# EAGLE design DASH_BOARD_V_2.0 (EAGLE 9.2.2)
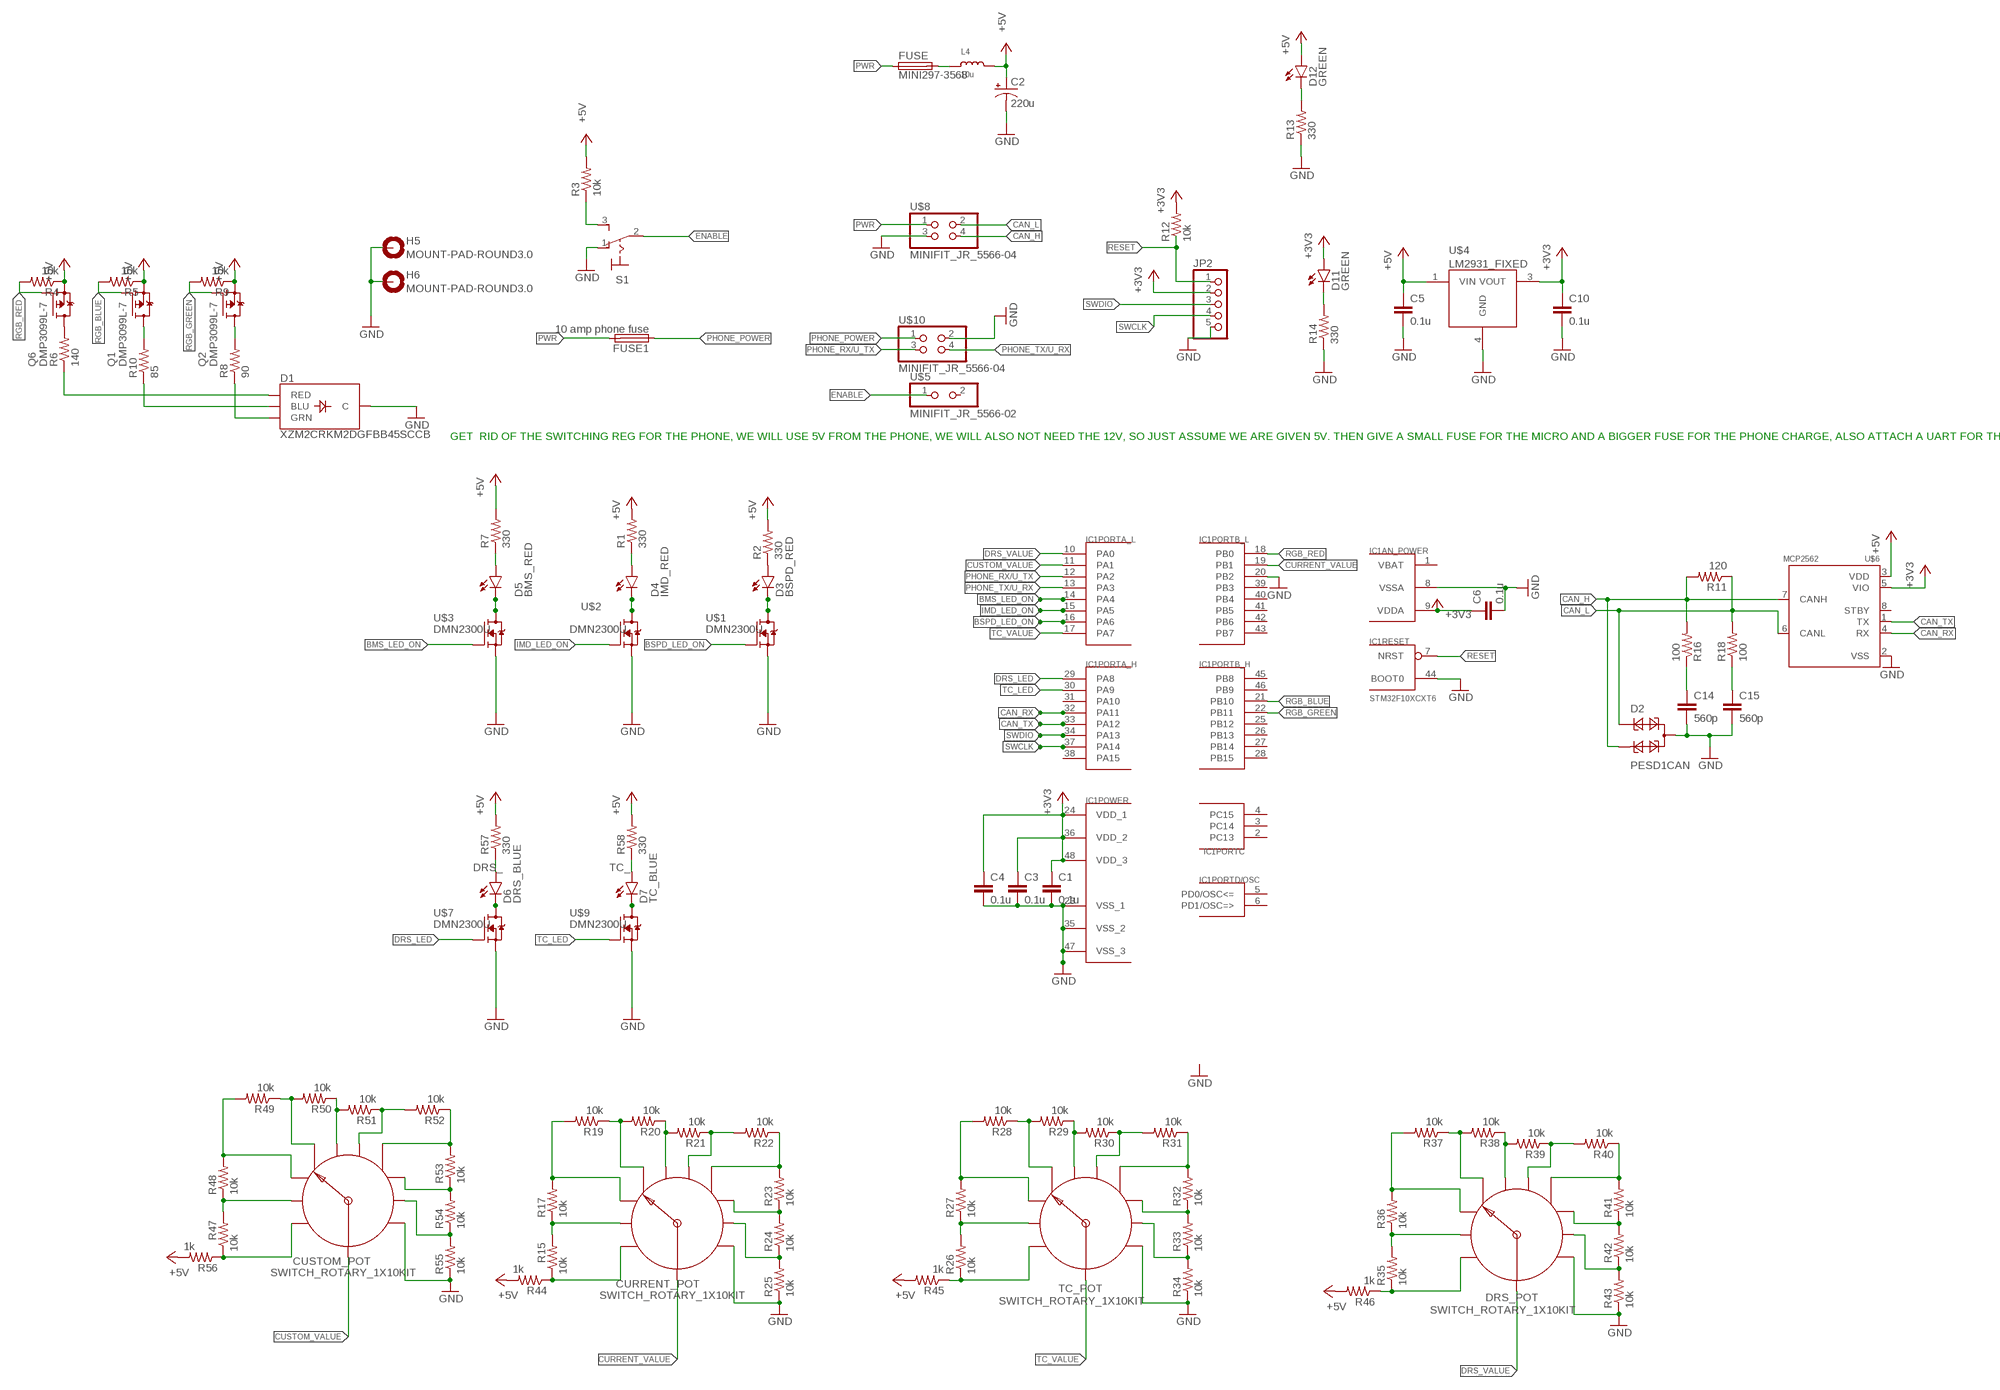
[diagram p0: schematic, sheet 1]

## Parts
C1  0.1u  C-EUC0805K  [C0805K]
C2  220u  CPOL-USE2.5-7  [E2,5-7]
C3  0.1u  C-EUC0805K  [C0805K]
C4  0.1u  C-EUC0805K  [C0805K]
C5  0.1u  C-EUC0805K  [C0805K]
C6  0.1u  C-EUC0805K  [C0805K]
C10  0.1u  C-EUC0805K  [C0805K]
C14  560p  C-EUC0805K  [C0805K]
C15  560p  C-EUC0805K  [C0805K]
CURRENT_POT  SWITCH_ROTARY_1X10KIT  [ROTARY_SWITCH_1X10_KIT]
CUSTOM_POT  SWITCH_ROTARY_1X10KIT  [ROTARY_SWITCH_1X10_KIT]
D1  XZM2CRKM2DGFBB45SCCB  SUNLEDSMD1  [PLCC4SMDLED]
D2  PESD1CAN  [SOT23]
D3  BSPD_RED  LED-GREEN0603  [LED-0603]
D4  IMD_RED  LED-GREEN0603  [LED-0603]
D5  BMS_RED  LED-GREEN0603  [LED-0603]
D6  DRS_BLUE  LED-GREEN0603  [LED-0603]
D7  TC_BLUE  LED-GREEN0603  [LED-0603]
D11  GREEN  LED-GREEN0603  [LED-0603]
D12  GREEN  LED-GREEN0603  [LED-0603]
DRS_POT  SWITCH_ROTARY_1X10KIT  [ROTARY_SWITCH_1X10_KIT]
FUSE  MINI297-3568  [3568]
FUSE1  10 amp phone fuse  MINI297-3568  [3568]
H5  MOUNT-PAD-ROUND3.0  [3,0-PAD]
H6  MOUNT-PAD-ROUND3.0  [3,0-PAD]
IC1  STM32F10XCXT6  [TQFP48]
JP2  PINHD-1X5  [1X05]
L4  10u  INDUCTORNR5040  [INDUCTOR_5X5MM_NR5040_NOTHERMALS]
Q1  DMP3099L-7  [SOT23]
Q2  DMP3099L-7  [SOT23]
Q6  DMP3099L-7  [SOT23]
R1  330  R-US_R0805  [R0805]
R2  330  R-US_R0805  [R0805]
R3  10k  R-US_R0805  [R0805]
R4  10k  R-US_R0805  [R0805]
R5  10k  R-US_R0805  [R0805]
R6  140  R-US_R0805  [R0805]
R7  330  R-US_R0805  [R0805]
R8  90  R-US_R0805  [R0805]
R9  10k  R-US_R0805  [R0805]
R10  85  R-US_R0805  [R0805]
R11  120  R-US_R0805  [R0805]
R12  10k  R-US_R0805  [R0805]
R13  330  R-US_R0603  [R0603]
R14  330  R-US_R0603  [R0603]
R15  10k  R-US_R0805  [R0805]
R16  100  R-US_R0805  [R0805]
R17  10k  R-US_R0805  [R0805]
R18  100  R-US_R0805  [R0805]
R19  10k  R-US_R0805  [R0805]
R20  10k  R-US_R0805  [R0805]
R21  10k  R-US_R0805  [R0805]
R22  10k  R-US_R0805  [R0805]
R23  10k  R-US_R0805  [R0805]
R24  10k  R-US_R0805  [R0805]
R25  10k  R-US_R0805  [R0805]
R26  10k  R-US_R0805  [R0805]
R27  10k  R-US_R0805  [R0805]
R28  10k  R-US_R0805  [R0805]
R29  10k  R-US_R0805  [R0805]
R30  10k  R-US_R0805  [R0805]
R31  10k  R-US_R0805  [R0805]
R32  10k  R-US_R0805  [R0805]
R33  10k  R-US_R0805  [R0805]
R34  10k  R-US_R0805  [R0805]
R35  10k  R-US_R0805  [R0805]
R36  10k  R-US_R0805  [R0805]
R37  10k  R-US_R0805  [R0805]
R38  10k  R-US_R0805  [R0805]
R39  10k  R-US_R0805  [R0805]
R40  10k  R-US_R0805  [R0805]
R41  10k  R-US_R0805  [R0805]
R42  10k  R-US_R0805  [R0805]
R43  10k  R-US_R0805  [R0805]
R44  1k  R-US_R0805  [R0805]
R45  1k  R-US_R0805  [R0805]
R46  1k  R-US_R0805  [R0805]
R47  10k  R-US_R0805  [R0805]
R48  10k  R-US_R0805  [R0805]
R49  10k  R-US_R0805  [R0805]
R50  10k  R-US_R0805  [R0805]
R51  10k  R-US_R0805  [R0805]
R52  10k  R-US_R0805  [R0805]
R53  10k  R-US_R0805  [R0805]
R54  10k  R-US_R0805  [R0805]
R55  10k  R-US_R0805  [R0805]
R56  1k  R-US_R0805  [R0805]
R57  330  R-US_R0805  [R0805]
R58  330  R-US_R0805  [R0805]
S1  320-916  [320-916]
TC_POT  SWITCH_ROTARY_1X10KIT  [ROTARY_SWITCH_1X10_KIT]
U$1  DMN2300U  [SOT23]
U$2  DMN2300U  [SOT23]
U$3  DMN2300U  [SOT23]
U$4  LM2931_FIXED  [DPAK]
U$5  MINIFIT_JR_5566-02  [MINIFIT_JR_5566-02]
U$6  MCP2562  [SOIC8]
U$7  DMN2300U  [SOT23]
U$8  MINIFIT_JR_5566-04  [MINIFIT_JR_5566-04]
U$9  DMN2300U  [SOT23]
U$10  MINIFIT_JR_5566-04  [MINIFIT_JR_5566-04]

## Nets
+3V3: C1.1 C3.1 C4.1 C6.1 C10.1 D11.A IC1.9(AN_POWER:VDDA) IC1.24(POWER:VDD_1) IC1.36(POWER:VDD_2) IC1.48(POWER:VDD_3) JP2.2 R12.2 U$4.3(VOUT) U$6.5(VIO)
+5V: C2.+ C5.1 D12.A L4.P$2 Q1.2(S) Q2.2(S) Q6.2(S) R1.2 R2.2 R3.2 R4.1 R5.1 R7.2 R9.1 R44.2 R45.2 R46.2 R56.2 R57.2 R58.2 U$4.1(VIN) U$6.3(VDD)
BMS_LED: D5.A R7.1
BMS_LED_ON: IC1.14(PORTA_L:PA4) U$3.1(G)
BSPD_LED: D3.A R2.1
BSPD_LED_ON: IC1.16(PORTA_L:PA6) U$1.1(G)
CAN_H: D2.2 R11.2 R16.2 U$6.7(CANH) U$8.4
CAN_L: D2.1 R11.1 R18.2 U$6.6(CANL) U$8.2
CAN_RX: IC1.32(PORTA_H:PA11) U$6.4(RX)
CAN_TX: IC1.33(PORTA_H:PA12) U$6.1(TX)
CURRENT_VALUE: CURRENT_POT.COMMON IC1.19(PORTB_L:PB1)
CUSTOM_VALUE: CUSTOM_POT.COMMON IC1.11(PORTA_L:PA1)
DRS_: D6.A R57.1
DRS_LED: IC1.29(PORTA_H:PA8) U$7.1(G)
DRS_VALUE: DRS_POT.COMMON IC1.10(PORTA_L:PA0)
ENABLE: S1.2(P) U$5.1
GND: C1.2 C2.- C3.2 C4.2 C5.2 C6.2 C10.2 C14.2 C15.2 CURRENT_POT.10 CUSTOM_POT.10 D1.4(C) D2.3 DRS_POT.10 H5.B3,0(MOUNT) H6.B3,0(MOUNT) IC1.8(AN_POWER:VSSA) IC1.20(PORTB_L:PB2) IC1.23(POWER:VSS_1) IC1.35(POWER:VSS_2) IC1.44(RESET:BOOT0) IC1.47(POWER:VSS_3) JP2.5 R13.1 R14.1 R25.1 R34.1 R43.1 R55.1 S1.1(O) TC_POT.10 U$1.2(S) U$2.2(S) U$3.2(S) U$4.4(GND) U$6.2(VSS) U$7.2(S) U$8.3 U$9.2(S) U$10.2
IMD_LED: D4.A R1.1
IMD_LED_ON: IC1.15(PORTA_L:PA5) U$2.1(G)
N$1: Q6.3(D) R6.2
N$2 [PWR]: C14.1 R16.1
N$3: D5.C U$3.3(D)
N$4: R3.1 S1.3(S)
N$5: D1.2(GRN) R8.1
N$6 [PWR_IN]: FUSE.P$2 FUSE.P$3 L4.P$1
N$7: CURRENT_POT.2 R15.2 R17.1
N$8: D4.C U$2.3(D)
N$9 [PWR]: C15.1 R18.1
N$10: D12.C R13.2
N$11: D11.C R14.2
N$12: D3.C U$1.3(D)
N$13: CURRENT_POT.3 R17.2 R19.2
N$14: CURRENT_POT.1 R15.1 R44.1
N$15: D1.3(BLU) R10.1
N$16: D1.1(RED) R6.1
N$17: CURRENT_POT.4 R19.1 R20.2
N$18: CURRENT_POT.5 R20.1 R21.2
N$19: CURRENT_POT.6 R21.1 R22.2
N$20: CURRENT_POT.7 R22.1 R23.2
N$21: CURRENT_POT.8 R23.1 R24.2
N$22: CURRENT_POT.9 R24.1 R25.2
N$23: R26.1 R45.1 TC_POT.1
N$24: Q1.3(D) R10.2
N$25: R26.2 R27.1 TC_POT.2
N$26: R27.2 R28.2 TC_POT.3
N$27: Q2.3(D) R8.2
N$28: R28.1 R29.2 TC_POT.4
N$29: R29.1 R30.2 TC_POT.5
N$30: R30.1 R31.2 TC_POT.6
N$31: R31.1 R32.2 TC_POT.7
N$32: R32.1 R33.2 TC_POT.8
N$33: R33.1 R34.2 TC_POT.9
N$34: CUSTOM_POT.2 R47.2 R48.1
N$35: CUSTOM_POT.3 R48.2 R49.2
N$36: DRS_POT.2 R35.2 R36.1
N$37: DRS_POT.3 R36.2 R37.2
N$38: DRS_POT.1 R35.1 R46.1
N$39: DRS_POT.4 R37.1 R38.2
N$40: DRS_POT.5 R38.1 R39.2
N$41: DRS_POT.6 R39.1 R40.2
N$42: DRS_POT.7 R40.1 R41.2
N$43: DRS_POT.8 R41.1 R42.2
N$44: DRS_POT.9 R42.1 R43.2
N$45: CUSTOM_POT.4 R49.1 R50.2
N$46: CUSTOM_POT.5 R50.1 R51.2
N$47: CUSTOM_POT.6 R51.1 R52.2
N$48: CUSTOM_POT.7 R52.1 R53.2
N$49: CUSTOM_POT.8 R53.1 R54.2
N$50: CUSTOM_POT.9 R54.1 R55.2
N$51: CUSTOM_POT.1 R47.1 R56.1
N$52: D6.C U$7.3(D)
N$53: D7.C U$9.3(D)
PHONE_POWER: FUSE1.P$1 FUSE1.P$4 U$10.1
PHONE_RX/U_TX: IC1.12(PORTA_L:PA2) U$10.3
PHONE_TX/U_RX: IC1.13(PORTA_L:PA3) U$10.4
PWR [PWR_IN]: FUSE1.P$2 FUSE1.P$3 FUSE.P$1 FUSE.P$4 U$8.1
RESET: IC1.7(RESET:NRST) JP2.1 R12.1
RGB_BLUE: IC1.21(PORTB_H:PB10) Q1.1(G) R5.2
RGB_GREEN: IC1.22(PORTB_H:PB11) Q2.1(G) R9.2
RGB_RED: IC1.18(PORTB_L:PB0) Q6.1(G) R4.2
SWCLK: IC1.37(PORTA_H:PA14) JP2.4
SWDIO: IC1.34(PORTA_H:PA13) JP2.3
TC_: D7.A R58.1
TC_LED: IC1.30(PORTA_H:PA9) U$9.1(G)
TC_VALUE: IC1.17(PORTA_L:PA7) TC_POT.COMMON
Unconnected: IC1.2(PORTC:PC13) IC1.3(PORTC:PC14) IC1.4(PORTC:PC15) IC1.5(PORTD/OSC:PD0/OSC<=) IC1.6(PORTD/OSC:PD1/OSC=>) IC1.25(PORTB_H:PB12) IC1.26(PORTB_H:PB13) IC1.27(PORTB_H:PB14) IC1.28(PORTB_H:PB15) IC1.31(PORTA_H:PA10) IC1.38(PORTA_H:PA15) IC1.39(PORTB_L:PB3) IC1.40(PORTB_L:PB4) IC1.41(PORTB_L:PB5) IC1.42(PORTB_L:PB6) IC1.43(PORTB_L:PB7) IC1.45(PORTB_H:PB8) IC1.46(PORTB_H:PB9) U$5.2 U$6.8(STBY)

## Notes on the sheet
- GET  RID OF THE SWITCHING REG FOR THE PHONE, WE WILL USE 5V FROM THE PHONE, WE WILL ALSO NOT NEED THE 12V, SO JUST ASSUME WE ARE GIVEN 5V. THEN GIVE A SMALL FUSE FOR THE MICRO AND A BIGGER FUSE FOR THE PHONE CHARGE, ALSO ATTACH A UART FOR THE PHONE

## Power pins joined to a net without a drawn wire
VBAT: IC1.1(AN_POWER:VBAT)

## Library data of the parts
C1 C3-C6 C10 C14 C15 = rcl:C-EU: CAPACITOR, European symbol
C2 = rcl:CPOL-US: POLARIZED CAPACITOR, American symbol; SPICEPREFIX: C
CURRENT_POT CUSTOM_POT DRS_POT TC_POT = Testing:SWITCH_ROTARY_1X10: SWCH-12120; PROD_ID: SWCH-12120; VALUE: 1x10
D1 = SparkFun-LED:SUNLED: LED-RGB Common Cathode XZM2CRKM2DGFBB45SCCB Packages: PLCC4 SparkFun Products: Lilypad Prototyping Board <[https://www.sparkfun.com/products/9264]>; PROD_ID: DIO-13722
D2 = diode:PESD1CAN: CAN bus ESD protection diode Source: http://www.nxp.com/documents/data_sheet/PESD1CAN.pdf
D3-D7 = SparkFun-LED:LED-GREEN: Various green LEDs Green LEDs used in SFE Production 0603- DIO-00821 LARGE- DIO-00862 LILYPAD- DIO-09910; PROD_ID: DIO-00821; VALUE: GREEN
D11 D12 = SparkFun-LED:LED-GREEN: Various green LEDs Green LEDs used in SFE Production 0603- DIO-00821 LARGE- DIO-00862 LILYPAD- DIO-09910; PROD_ID: DIO-00821
FUSE FUSE1 = Fuse:MINI297-3568
H5 H6 = holes:MOUNT-PAD-ROUND: MOUNTING PAD, round
IC1 = stm32:STM32F10XCXT6: ST STM32F101/103 48pin LQFP
JP2 = Headers_IFE:PINHD-1X5: PIN HEADER
L4 = microbuilder:INDUCTOR: Inductors 0603: 10nH Ceramic Inductor - microwire antenna/RF (Digikey: 712-1434-2-ND) 0805: 560nH Ceramic Inductor - RF (Digikey: 553-1047-1-ND) 270nH Ceramic Inductor - Q = 40@250MHz, +-5%, 1 Ohm DC Resistance (Digikey: 535-10506-2-ND) 1007 (2518 Metric) SMT: 10µH 10% 250mOhm 820mA 1007 Inductor (Digikey: 587-2189-1-ND) 22µH 10% 500mOhm 580mA 1007 Inductor (Digikey: 587-2190-1-ND) 47µH 10% 950mOhm 420mA 1007 Inductor (Digikey: 587-2191-1-ND) 47µH 5% 100mOhm 1A 1008 Inductor (Digikey: 732-1816-1-ND) 5.0x5.0mm (Taiyo Yuden NR5040 Series) 6.8µH 20% 2.3A 64mOhm Inductor (Digikey: 587-2374-2-ND) 5.0x5.0mm (TDK VLC5045 Series) 4.7µH 20% 3.3A 34mOhm Inductor (Digikey: 445-6526-1-ND) 6.8µH 20% 2.7A 46mOhm Inductor (Digikey: 445-6527-1-ND) 6.0x6.0mm (TDK VLC6045 Series) 4.7µH 20% 3.8A 27mOhm Inductor (Digikey: 445-6538-2-ND) 6.8µH 20% 3A 41mOhm Inductor (Digikey: 445-6540-1-ND) 6.2µH 30% 2.2A 45mOhm Inductor (Digikey: SRR5028-6R2YCT-ND) - Not TDK VLC6045 but footprint should match 6.0x6.0mm (TDK SLF6045 Series) 6.8uH 30% 2A 33mOhm Inductor (Digikey: 445-4572-1-ND, Mouser: 810-SLF645T6R8N2R0PF) 6.0x6.0mm (Sumida CDRH5D28 Series) 6.2uH 30% 1.8A 45mOhm Inductor (Digikey: 308-1542-1-ND) Taiyo Yuden NR3015T2R2M - 2.2uH 20% 1.5A (Digikey: 587-1648-2-ND, Mouser: 963-NR3015T2R2M) - Used with TI TPS62172 CoilCraft RFID Transponder Coil - MA5532-AE (For use with AS3935 Lightning Sensor)
Q1 Q2 Q6 = TRANS:DMP3099L-7: DMP3099L-7 P-Channel Vgs(th) = 2.1V, Rds(on) = 64 mohm, Vds(max) = 30V
R1-R10 R12 R15 R17 R19-R58 = resistor:R-US_: RESISTOR, American symbol
R11 R16 R18 = rcl:R-US_: RESISTOR, American symbol
R13 R14 = rcl:R-US_: RESISTOR, American symbol; SPICEPREFIX: R
S1 = switch:320-916: TOGGLE SWITCH distributor RS Components
U$1-U$3 U$7 U$9 = Display_Custom:DMN2300U: 20V N-Channel Mosfet SOT23 https://www.diodes.com/assets/Datasheets/DMN2300U.pdf
U$4 = SparkFun-PowerIC:LM2931_FIXED: LDO regulator with reverse battery protection- very durable!
U$5 = Display_Custom:MINIFIT_JR_5566-02: Molex Minifit JR 5566-02 Vertical 2 position headder https://www.molex.com/pdm_docs/sd/039293026_sd.pdf
U$6 = MICROCHIP:MCP2562: MCP2562 High Speed CAN Tranceiver The MCP2561/2 is Microchip Technology Inc. second generation high-speed CAN transceiver. It serves as an interface between a CAN protocol controller and the physical two-wire CAN bus. The device meets the automotive requirements for high-speed (1 Mb/s), low quiescent current, electromagnetic compatibility (EMC) and electrostatic discharge (ESD). The device family members are: • MCP2561 with SPLIT pin • MCP2562 with VIO pin Datasheet <http://ww1.microchip.com/downloads/en/DeviceDoc/20005167C.pdf> Microchip <https://www.microchip.com/wwwproducts/en/MCP2562> Digikey <https://www.digikey.com/product-detail/en/microchip-technology/MCP2562T-E-SN/MCP2562T-E-SNCT-ND/5011025>
U$8 U$10 = Display_Custom:MINIFIT_JR_5566-04: Molex Minifit JR 5566-04 Vertical 4 position headder https://www.molex.com/pdm_docs/sd/039293026_sd.pdf

## Net classes
0 default: width 0.254 mm
1 PWR: width 0.254 mm
3 PWR_IN: width 0.406 mm

## Board
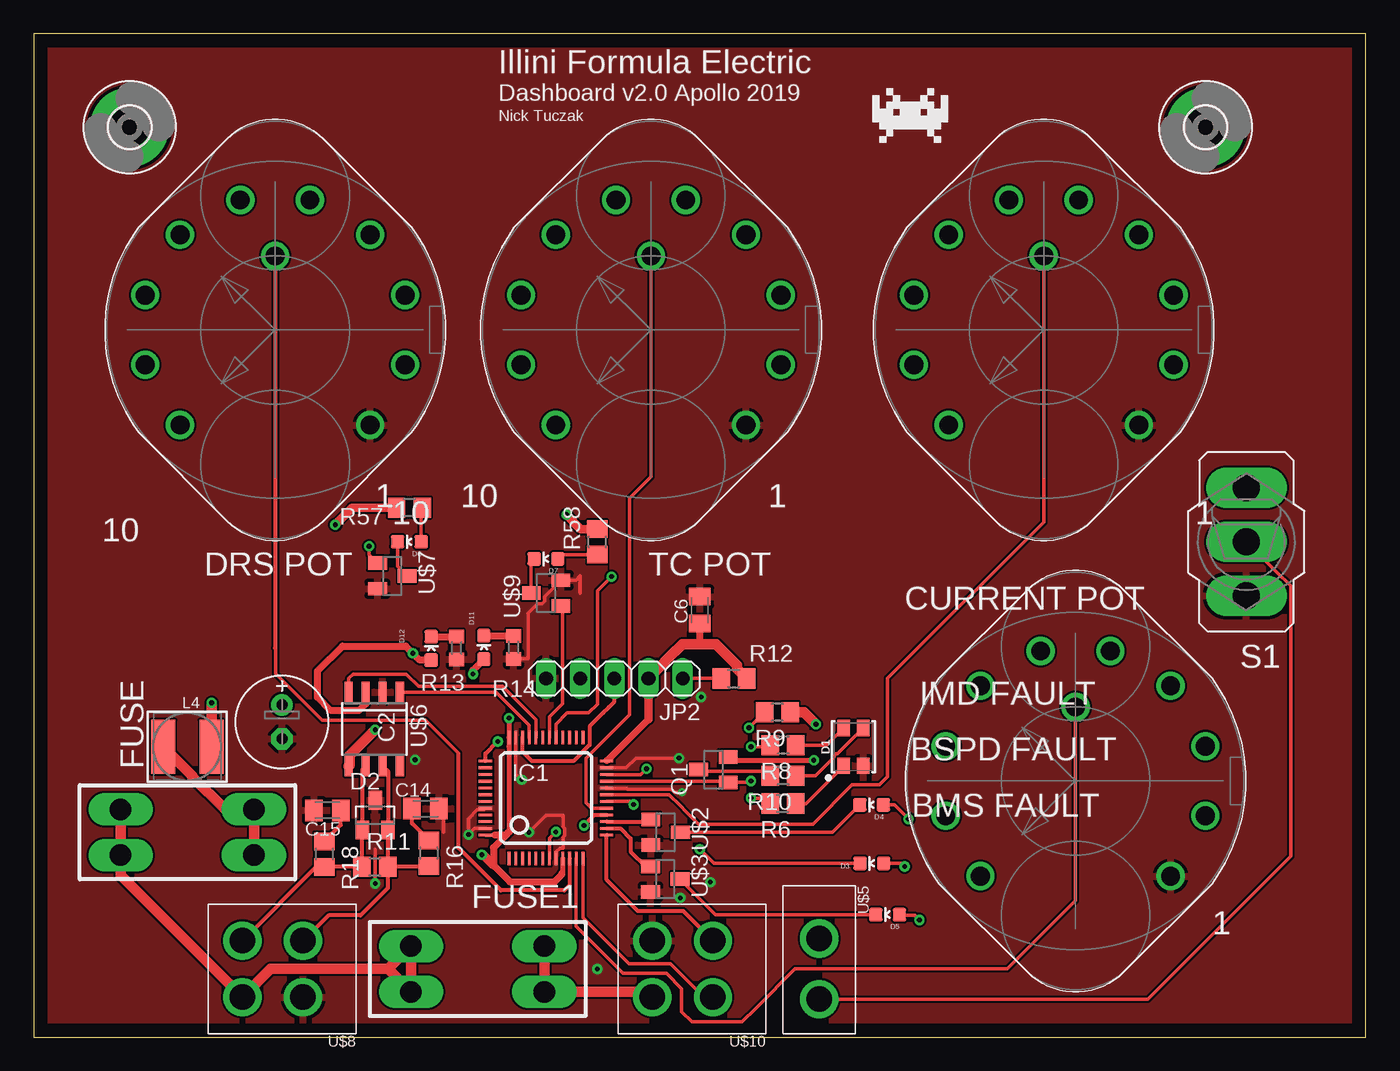
[diagram p1: board, top side]
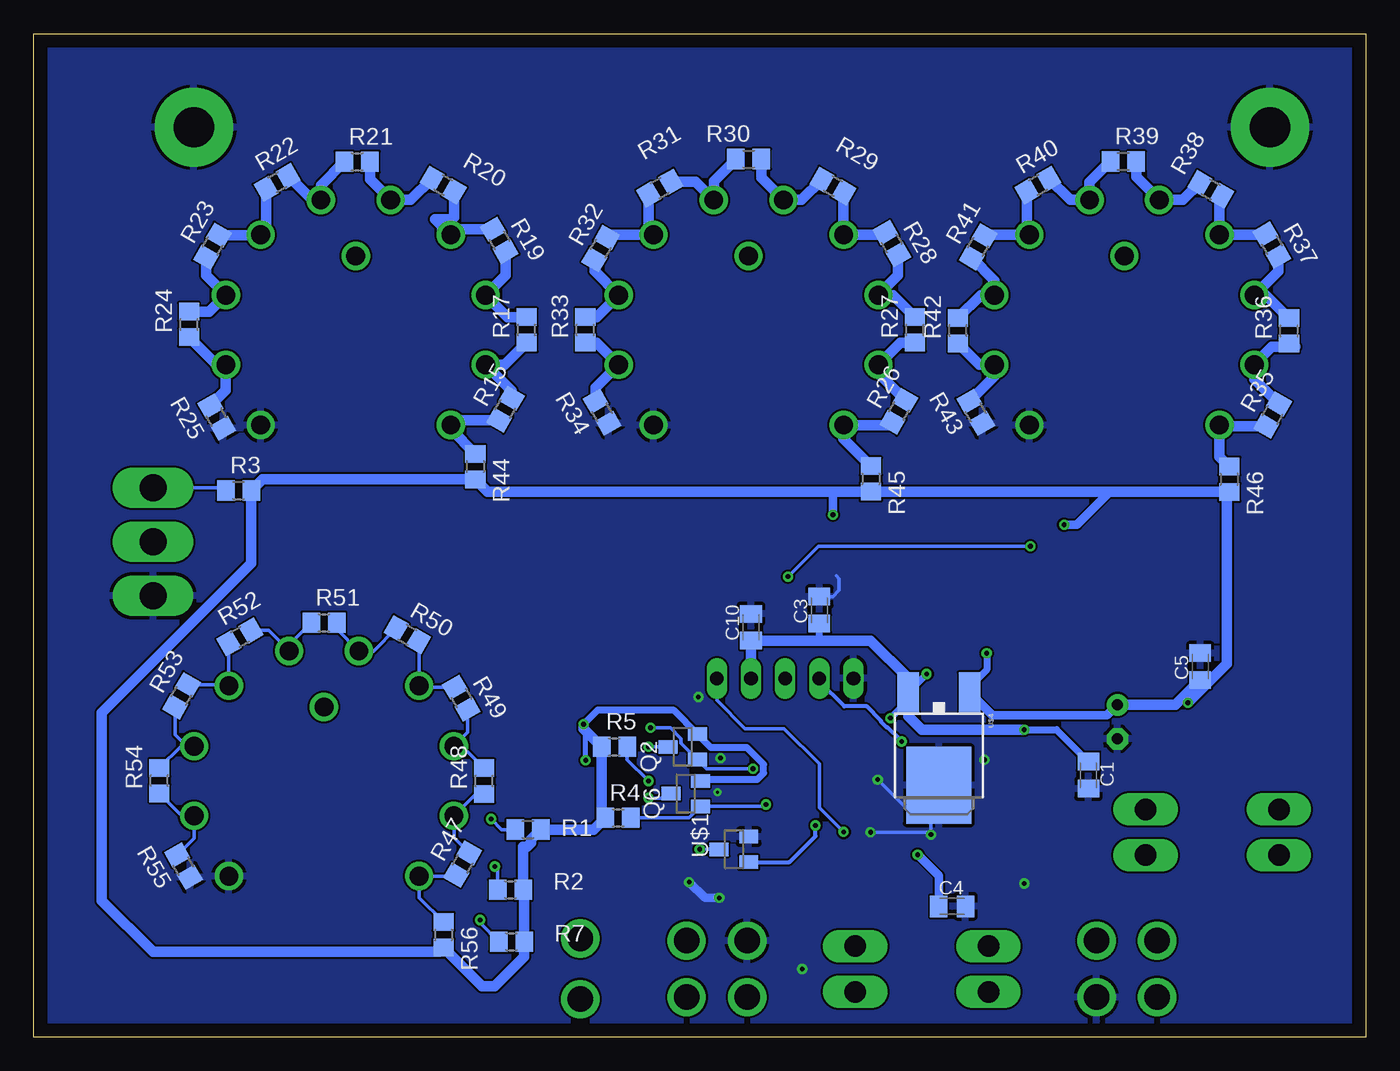
[diagram p2: board, bottom side, seen from below]

Size 99.06 x 74.6 mm. Coordinates in mm from the lower left corner, seen from the top.
Outline: 0,0 99.06,0 99.04,74.6 0,74.6 0,0
Copper layers (1*16): Top 0.035mm / dielectric 1.5mm / Bottom 0.035mm
Design rules "default": minimum track width 6mil, minimum drill 0.35mm, track to track 6mil, track to pad 6mil, pad to pad 6mil, via to via 6mil, smd to smd 6mil, copper to edge 40mil, drill to drill 6mil, minimum pad ring 10mil, minimum via ring 8mil, stop-mask expansion 4mil, vias tented up to drill 0mil, thermal gap 10mil

### Footprints (pad centres in the part's own frame; a part is rotated, then mirrored left to right if it is on the bottom)
C0805K = smd 1.3 x 1.6: 1 -1,0; 2 1,0
E2,5-7 = drill 0.813 pad 1.6: + -1.27,0 | drill 0.813 pad 1.6 octagon: - 1.27,0
ROTARY_SWITCH_1X10_KIT = drill 1.4: 1 7.071,7.071; 2 9.659,2.588; 3 9.659,-2.588; 4 7.071,-7.071; 5 2.588,-9.659; 6 -2.588,-9.659; 7 -7.071,-7.071; 8 -9.659,-2.588; 9 -9.659,2.588; 10 -7.071,7.071; COMMON 0,-5.5
PLCC4SMDLED = smd 1.2 x 0.9: 1 -1.4,0.725; 2 1.4,0.725; 3 1.4,-0.725; 4 -1.4,-0.725
SOT23 = smd 1 x 1.4: 1 -0.95,-1.1; 2 0.95,-1.1; 3 0,1.1
LED-0603 = smd 1 x 1: A 0,-0.877; C 0,0.877
3568 = drill 1.6 long: P$1 -4.96,1.7; P$2 4.96,1.7; P$3 4.96,-1.7; P$4 -4.96,-1.7
3,0-PAD = drill 3 pad 5.842: B3,0 0,0
TQFP48 = smd 0.2 x 1: 1 -2.75,-4.5; 2 -2.25,-4.5; 3 -1.75,-4.5; 4 -1.25,-4.5; 5 -0.75,-4.5; 6 -0.25,-4.5; 7 0.25,-4.5; 8 0.75,-4.5; 9 1.25,-4.5; 10 1.75,-4.5; 11 2.25,-4.5; 12 2.75,-4.5; 25 2.75,4.5; 26 2.25,4.5; 27 1.75,4.5; 28 1.25,4.5; 29 0.75,4.5; 30 0.25,4.5; 31 -0.25,4.5; 32 -0.75,4.5; 33 -1.25,4.5; 34 -1.75,4.5; 35 -2.25,4.5; 36 -2.75,4.5 | smd 1 x 0.2: 13 4.5,-2.75; 14 4.5,-2.25; 15 4.5,-1.75; 16 4.5,-1.25; 17 4.5,-0.75; 18 4.5,-0.25; 19 4.5,0.25; 20 4.5,0.75; 21 4.5,1.25; 22 4.5,1.75; 23 4.5,2.25; 24 4.5,2.75; 37 -4.5,2.75; 38 -4.5,2.25; 39 -4.5,1.75; 40 -4.5,1.25; 41 -4.5,0.75; 42 -4.5,0.25; 43 -4.5,-0.25; 44 -4.5,-0.75; 45 -4.5,-1.25; 46 -4.5,-1.75; 47 -4.5,-2.25; 48 -4.5,-2.75
1X05 = drill 1.016 long: 1 -5.08,0; 2 -2.54,0; 3 0,0; 4 2.54,0; 5 5.08,0
INDUCTOR_5X5MM_NR5040_NOTHERMALS = smd 1.8 x 4: P$1 -1.8,0; P$2 1.8,0
R0805 = smd 1.3 x 1.5: 1 -0.95,0; 2 0.95,0
R0603 = smd 1 x 1.1: 1 -0.85,0; 2 0.85,0
320-916 = drill 2.007 long: 1 0,4.013; 2 0,0; 3 0,-4.013
DPAK = smd 1.6 x 3: 1 -2.28,-5.31; 3 2.28,-5.31 | smd 4.826 x 5.715: 4 0,1.588
MINIFIT_JR_5566-02 = drill 1.9: 1 0,2.25; 2 0,-2.25
SOIC8 = smd 0.6 x 1.5: 1 -1.905,-2.75; 2 -0.635,-2.75; 3 0.635,-2.75; 4 1.905,-2.75; 5 1.905,2.75; 6 0.635,2.75; 7 -0.635,2.75; 8 -1.905,2.75
MINIFIT_JR_5566-04 = drill 1.9: 1 -2.1,2.25; 2 2.1,2.25; 3 -2.1,-2.25; 4 2.1,-2.25

### Placement (x,y rotation side)
C1  20.62,19.48 270 bottom
C2  18.47,23.44 270 top
C3  40.64,31.75 90 bottom
C4  30.76,9.73 0 bottom
C5  12.32,27.56 90 bottom
C6  49.53,31.75 90 top
C10  45.72,30.48 90 bottom
C14  29.13,16.99 0 top
C15  21.84,16.87 180 top
CURRENT_POT  75.11,52.58 180 top
CUSTOM_POT  77.47,19.05 180 top
D1  60.96,21.59 90 top
D2  25.4,16.51 0 top
D3  62.33,12.93 90 top
D4  62.31,17.27 90 top
D5  63.5,9.12 90 top
D6  27.94,36.83 90 top
D7  38.1,35.56 90 top
D11  33.48,28.98 0 top
D12  29.57,28.91 0 top
DRS_POT  17.96,52.58 180 top
FUSE  11.43,15.24 0 top
FUSE1  33.02,5.08 180 top
H5  87.15,67.64 0 top
H6  7.14,67.64 180 top
IC1  38.1,17.78 0 top
JP2  43.18,26.67 180 top
L4  11.43,21.59 0 top
Q1  50.55,19.89 90 top
Q2  50.8,21.59 90 bottom
Q6  50.57,18.11 90 bottom
R1  62.31,15.44 0 bottom
R2  63.6,10.97 0 bottom
R3  83.82,40.64 0 bottom
R4  55.6,16.31 0 bottom
R5  55.88,21.59 0 bottom
R6  55.7,17.37 180 top
R7  63.53,7.11 0 bottom
R8  55.73,21.72 180 top
R9  55.3,24.16 180 top
R10  55.73,19.43 180 top
R11  25.37,12.67 0 top
R12  52.07,26.67 0 top
R13  31.45,28.93 90 top
R14  35.69,28.98 90 top
R15  63.98,46.69 60 bottom
R16  29.39,13.69 270 top
R17  62.41,52.58 90 bottom
R18  21.62,13.61 270 top
R19  64.44,59.23 300 bottom
R20  68.61,63.35 330 bottom
R21  75.01,65.07 0 bottom
R22  80.95,63.55 30 bottom
R23  85.75,58.8 60 bottom
R24  87.5,52.98 90 bottom
R25  85.45,46.1 120 bottom
R26  34.72,46.53 60 bottom
R27  33.53,52.58 90 bottom
R28  35.26,59 300 bottom
R29  39.62,63.27 330 bottom
R30  45.9,65.28 0 bottom
R31  52.5,63.12 30 bottom
R32  56.9,58.62 60 bottom
R33  58.04,52.58 90 bottom
R34  56.79,46.46 120 bottom
R35  6.93,46.25 60 bottom
R36  5.71,52.5 90 bottom
R37  6.99,58.88 300 bottom
R38  11.53,63.02 330 bottom
R39  18.03,65.1 0 bottom
R40  24.38,63.35 30 bottom
R41  28.83,58.75 60 bottom
R42  30.33,52.53 90 bottom
R43  29.01,46.46 120 bottom
R44  66.22,42.42 270 bottom
R45  36.8,41.5 270 bottom
R46  10.16,41.48 270 bottom
R47  67.16,12.88 60 bottom
R48  65.56,19.05 90 bottom
R49  67.26,25.2 300 bottom
R50  71.27,29.92 330 bottom
R51  77.47,30.81 0 bottom
R52  83.72,29.77 30 bottom
R53  88.06,25.37 60 bottom
R54  89.71,19.08 90 bottom
R55  87.91,12.73 120 bottom
R56  68.58,7.62 270 bottom
R57  27.94,39.37 180 top
R58  41.91,36.83 90 top
S1  90.17,36.83 180 top
TC_POT  45.9,52.58 180 top
U$1  46.99,13.97 90 bottom
U$2  46.99,15.24 270 top
U$3  46.96,11.76 270 top
U$4  31.75,20.32 180 bottom
U$5  58.42,5.08 180 top
U$6  25.32,22.91 180 top
U$7  26.67,34.29 270 top
U$8  17.78,5.08 90 top
U$9  38.1,33.02 90 top
U$10  48.26,5.08 90 top

### Tracks (layer width: path | path; a pad name or v marks a point on that pad's centre or on a via)
+3V3  (via drill 0.35)
  Top 0.254: IC1.48 34.29,15.02 | IC1.24 42.63,20.56
  Top 0.381: 39.29,12.17 39.35,12.22 IC1.9 | 35.36,15.27 35.36,21.59 35.35,21.6 IC1.36 v35.36,23.72
  Top 0.508: 35.12,15.02 34.29,15.02 | 35.12,15.02 34.19,14.1 34.19,12.78 35.41,11.56 38.73,11.56 39.29,12.11 39.29,12.17 | 35.36,15.27 35.12,15.02 | v32.66,27 32.66,27.29 D11.A | 49.53,29.21 C6.1 | 45.72,23.65 42.63,20.56
  Top 0.635: JP2.2 45.72,23.65 | 34.19,12.78 33.4,13.56 v33.33,13.56
  Top 0.762: JP2.2 46.97,27.91 46.97,27.97 47.72,28.73 47.78,28.73 48.26,29.21 49.53,29.21 50.73,29.21 52.3,27.64 52.3,27.39 R12.2 | v25.4,22.86 23.5,20.95 23.5,20.24 U$6.5
  Bottom 0.508: v35.36,23.72 34.03,25.05 U$4.3 v32.66,27 | 40.64,29.48 C3.1 | v25.4,22.86 23,22.86 C1.1 | v35.36,23.72
  Bottom 0.635: v33.33,13.56 31.76,12 C4.1
  Bottom 0.762: JP2.2 C10.1 40.64,29.48 36.84,29.48 34.03,26.67 U$4.3 34.03,23.87 33.02,22.86 v25.4,22.86
+5V  (via drill 0.35)
  Top 0.381: Q1.2 51.88,20.6 v58.01,20.6
  Top 0.508: U$6.3 24.69,24.79 24.18,24.28 22.1,24.28 21.11,25.27 21.11,27.23 22.96,29.08 27.66,29.08 v28.19,28.55 28.71,28.03 D12.A
  Top 0.635: R57.2 23.7,39.37 v22.43,38.1 | R58.2 40.68,37.78 v39.62,38.84
  Top 0.762: L4.P$2 v13.23,24.86 v13.23,24.87 | v58.17,23.27 57.28,24.16 R9.1
  Bottom 0.381: v58.01,20.6 58.01,22.77 58.17,22.93
  Bottom 0.508: v58.17,23.27 57.1,24.33 51.49,24.33 Q2.2 48.7,21.54 46.04,21.54 44.78,20.28 44.78,19.63 45.24,19.17 49.36,19.17 Q6.2 | 29.19,25.35 29.67,25.83 28.19,27.31 v28.19,28.55
  Bottom 0.635: C2.+ 19.25,23.93 27.77,23.93 29.19,25.35 U$4.1 | 19.05,40.55 21.5,38.1 v22.43,38.1 | v39.62,38.84 39.62,40.4 39.78,40.55
  Bottom 0.762: v13.23,24.87 12.32,25.78 | 12.32,25.78 C5.1 14.16,24.71 C2.+ | 12.32,25.78 10.34,27.76 10.34,40.35 | 10.34,40.35 R46.2 | R45.2 10.54,40.55 10.34,40.35 | R45.2 39.78,40.55 65.3,40.55 R44.2 82.04,41.47 R3.2 82.87,35.24 93.98,24.13 93.98,10.16 90.17,6.35 68.9,6.35 R56.2 65.72,3.81 64.77,3.81 62.58,6 R7.2 62.58,10.9 R2.2 62.65,14.15 62.64,14.16 62.38,14.16 62.07,14.47 62.07,14.73 R1.2 57.41,15.44 R4.1 56.83,16.59 R5.1 58.17,22.93 v58.17,23.27 | 19.05,40.55 R45.2
BMS_LED  (via drill 0.35)
  Top 0.254: v65.86,8.71 65.53,9.04 65.53,9.07 64.43,9.07 D5.A
  Bottom 0.254: R7.1 65.86,8.5 v65.86,8.71
BMS_LED_ON
  Top 0.305: IC1.14 43.63,15.53 44.4,14.76 44.4,13.79 45.48,12.71 U$3.1
BSPD_LED  (via drill 0.35)
  Top 0.254: D3.A 64.54,12.93 v64.77,12.7
  Bottom 0.254: v64.77,12.7 64.55,12.48 R2.1
BSPD_LED_ON  (via drill 0.35)
  Top 0.305: v40.92,15.75 41.7,16.53 IC1.16
  Bottom 0.305: U$1.1 42.86,13.02 40.92,14.96 v40.92,15.75
CAN_H
  Top 0.305: R11.2 26.32,11.09 24.31,9.07 21.92,9.07 U$8.4 | R11.2 26.35,12.7 26.35,15.21 D2.2 26.35,19.77 U$6.7 | R16.2 29.32,12.68 R11.2
CAN_L
  Top 0.305: U$8.2 21.01,12.66 21.59,12.66 | 21.59,12.66 R18.2 | 21.59,12.66 21.6,12.68 R11.1 24.43,15.38 D2.1 24.45,19.92 U$6.6
CAN_RX
  Top 0.254: IC1.32 37.35,23.61 34.87,26.09 28.63,26.09 27.71,27 23.75,27 23.42,26.67 U$6.4
CAN_TX
  Top 0.254: U$6.1 34.38,25.66 36.85,23.19 36.85,23.18 IC1.33
CURRENT_VALUE
  Top 0.254: CURRENT_POT.COMMON 75.11,38.28 63.5,26.67 63.5,19.38 62.89,18.77 60.86,18.77 57.94,15.85 49.43,15.85 48.51,16.76 48.08,17.2 47.25,18.03 IC1.19
CUSTOM_VALUE
  Top 0.254: IC1.11 40.35,8.24 43.84,4.75 47.04,4.75 48.18,3.61 48.18,1.91 48.95,1.14 52.68,1.14 53.71,2.17 53.77,2.23 56.62,5.08 72.39,5.08 77.47,10.16 CUSTOM_POT.COMMON
DRS_
  Top 0.254: D6.A 28.82,38.8 28.94,39.09 28.89,39.14 R57.1
DRS_LED  (via drill 0.35)
  Top 0.254: IC1.29 38.85,23.28 39.67,24.11 41.27,24.11 41.94,24.77 41.94,33.2 v42.98,34.24 | v24.94,36.5 24.94,35.87 U$7.1
  Bottom 0.254: v42.98,34.24 40.72,36.5 v24.94,36.5
DRS_VALUE
  Top 0.254: 31.6,21.11 29.13,23.57 21.44,23.57 17.98,27.03 17.98,28.91 17.96,28.93
  Top 0.305: IC1.10 39.85,11.3 39.47,10.92 34.75,10.92 31.6,14.07 31.6,21.11 | DRS_POT.COMMON 17.96,28.93
ENABLE
  Top 0.254: U$5.1 82.84,2.83 93.46,13.45 93.46,33.56 92.41,34.6 92.4,34.6 S1.2
GND  (via drill 0.2, 0.35)
  Top 0.254: IC1.35 35.85,19.6 v36.3,19.15 | v25.4,11.43 25.4,11.8 25.39,11.81 25.39,13.54 25.4,13.54 25.4,13.97 | IC1.47 32.8,15.53 v32.33,15.06 32.33,16.26 32.98,16.91 33.48,16.91 IC1.44 | C14.2 30.48,16.65 30.48,15.24 | IC1.8 38.85,13.78 39.13,14.06 39.37,14.06 39.37,14.87 39.49,14.99 39.49,15.54 39.37,15.66 39.37,16.51 38.1,16.51 v36.83,15.24 | IC1.23 44.06,20.03 44.78,20.75 v47.98,20.75 | 40.64,33.02 40.64,34.29 40.32,33.97 U$9.2 37.98,32.75 37.98,32.4 37.82,32.24 37.47,32.24 36.75,31.52 36.75,28.12 35.7,28.12 R14.1 | v48.21,18.21 47.64,18.21 47.42,18.44 44.15,18.44 44.07,18.52 42.61,18.52 IC1.20
  Bottom 0.254: v36.3,19.15 34.19,17.04 33.53,17.04 32.33,15.85 v32.33,15.06 32.51,15.24 v36.83,15.24 | C3.2 39.64,32.75 39.17,33.22 39.17,34.09 39.37,34.29
  Bottom 0.635: v48.08,10.36 49.15,10.36 v50.32,11.53
  other vias: 41.91,5.08 28.37,20.62 49.63,25.3
  pour Top: 0,74.93 0,0 99.06,0 99.06,74.93
  pour Bottom: 0,74.93 0,0 99.06,0 99.06,74.93
IMD_LED  (via drill 0.35)
  Top 0.254: v65.05,16.23 64.01,17.27 D4.A
  Bottom 0.254: R1.1 64.26,15.44 v65.05,16.23
IMD_LED_ON
  Top 0.305: IC1.15 45.73,16.03 U$2.1
N$1  (via drill 0.35)
  Top 0.254: v53.34,17.78 54.35,17.78 R6.2
  Bottom 0.254: Q6.3 52,17.78 v53.34,17.78
N$2
  Top 0.305: R16.1 28.13,15.89 C14.1
N$3
  Top 0.254: U$3.3 50.71,9.12 D5.C
N$4
  Bottom 0.254: S1.3 84.97,40.84 R3.1
N$5
  Top 0.254: R8.1 58.96,21.72 D1.2
N$6
  Top 0.762: FUSE.P$3 FUSE.P$2 14.23,16.94 11.8,19.37 11.8,19.42 L4.P$1
N$7
  Bottom 0.762: R15.2 63.51,48.05 CURRENT_POT.2 64.05,49.99 R17.1
N$8
  Top 0.254: U$2.3 59.4,15.24 D4.C
N$9
  Top 0.305: R18.1 22.84,15.79 C15.1
N$10
  Top 0.508: D12.C R13.2
N$11
  Top 0.508: D11.C 35.66,29.86 R14.2
N$12  (via drill 0.35)
  Top 0.254: D3.C 50.57,12.93 v49.53,13.97
  Bottom 0.254: v49.53,13.97 U$1.3
N$13
  Bottom 0.762: R17.2 63.81,53.53 CURRENT_POT.3 63.97,56.65 R19.2
N$14
  Bottom 0.381: CURRENT_POT.1 68.04,45.19
  Bottom 0.762: R44.1 68.04,45.19 68.04,45.86 R15.1
N$15
  Top 0.254: R10.1 58.13,19.43 59.51,20.81 59.51,20.91 59.67,21.07 59.76,21.07 D1.3
N$16
  Top 0.254: D1.1 57.42,17.37 R6.1
N$17
  Bottom 0.762: R19.1 68.7,60.06 67.94,60.82 | 67.94,60.82 69.2,60.82 CURRENT_POT.4 | R20.2 67.78,60.97 67.94,60.82
N$18
  Bottom 0.762: R20.1 71.01,62.24 CURRENT_POT.5 74.06,63.77 R21.2
N$19
  Bottom 0.762: R21.1 77.7,63.34 CURRENT_POT.6 78.34,62.24 R22.2
N$20
  Bottom 0.762: R22.1 81.77,60.05 CURRENT_POT.7 82.2,59.62 R23.2
N$21
  Bottom 0.762: R23.1 86.22,56.62 CURRENT_POT.8 86,53.93 R24.2
N$22
  Bottom 0.762: R25.2 84.77,48.08 CURRENT_POT.9 85.46,49.99 R24.1
N$23
  Bottom 0.762: R26.1 35.4,45.51 TC_POT.1 38.83,44.48 R45.1
N$24
  Top 0.254: Q1.3 49.55,19.79 54.42,19.79 R10.2
N$25
  Bottom 0.762: R27.1 34.6,51.63 TC_POT.2 36.24,49.35 R26.2
N$26
  Bottom 0.762: R28.2 34.78,56.62 TC_POT.3 35.17,55.17 R27.2
N$27  (via drill 0.35)
  Top 0.254: v53.34,21.59 54.65,21.59 R8.2
  Bottom 0.254: Q2.3 v53.34,21.59
N$28
  Bottom 0.762: R28.1 35.91,59.65 TC_POT.4 38.83,62.77 R29.2
N$29
  Bottom 0.762: R29.1 41.96,62.24 TC_POT.5 44.95,63.88 R30.2
N$30
  Bottom 0.762: R30.1 48.49,63.64 TC_POT.6 49.84,63.59 R31.2
N$31
  Bottom 0.762: R31.1 53.33,60.01 TC_POT.7 56.22,59.65 R32.2
N$32
  Bottom 0.762: R32.1 57.37,56.98 TC_POT.8 57.2,53.53 R33.2
N$33
  Bottom 0.762: R33.1 57.2,51.63 TC_POT.9 57.27,48.28 R34.2
N$34
  Bottom 0.254: R47.2 67.81,14.83 CUSTOM_POT.2 66.17,18.1 R48.1
N$35
  Bottom 0.254: R48.2 67.2,21.64 CUSTOM_POT.3 66.78,22.66 R49.2
N$36
  Bottom 0.762: R35.2 8.3,48.91 DRS_POT.2 6.98,51.31 5.26,51.31 5.5,51.55 R36.1
N$37
  Bottom 0.762: R36.2 7.43,55.17 DRS_POT.3 6.51,56.95 R37.2
N$38
  Bottom 0.762: R35.1 10.81,45.43 DRS_POT.1 10.89,43.16 R46.1
N$39
  Bottom 0.762: R37.1 7.51,59.65 DRS_POT.4 10.89,62.37 R38.2
N$40
  Bottom 0.762: R38.1 13.61,62.24 DRS_POT.5 17.08,63.95 R39.2
N$41
  Bottom 0.762: R39.1 20.55,63.54 DRS_POT.6 21.98,62.24 R40.2
N$42
  Bottom 0.762: R40.1 25.21,59.83 DRS_POT.7 28.28,59.65 R41.2
N$43
  Bottom 0.762: R41.1 27.62,56.24 DRS_POT.8 28.64,55.17 R42.2
N$44
  Bottom 0.762: R42.1 28.74,49.99 DRS_POT.9 27.62,49.14 R43.2
N$45
  Bottom 0.254: R49.1 70.3,26.02 CUSTOM_POT.4 70.4,29.39 R50.2
N$46
  Bottom 0.254: R50.1 73.78,28.71 CUSTOM_POT.5 76.52,30.35 R51.2
N$47
  Bottom 0.254: R51.1 80.06,29.17 CUSTOM_POT.6 81.59,30.24 R52.2
N$48
  Bottom 0.254: R52.1 CUSTOM_POT.7 | CUSTOM_POT.7 | R53.2 84.62,26.2 CUSTOM_POT.7
N$49
  Bottom 0.254: R53.1 88.54,22.5 87.63,21.59 87.58,21.64 CUSTOM_POT.8 88.1,21.64 R54.2
N$50
  Bottom 0.254: R54.1 88.05,16.46 CUSTOM_POT.9 87.13,14.8 R55.2
N$51
  Bottom 0.254: R47.1 67.71,11.98 CUSTOM_POT.1 70.4,10.39 R56.1
N$52
  Top 0.254: U$7.3 27.06,35 D6.C
N$53
  Top 0.254: U$9.3 37,35.34 D7.C
PHONE_POWER
  Top 0.762: FUSE1.P$4 FUSE1.P$1 45.61,3.38 U$10.1
PHONE_RX/U_TX
  Top 0.254: U$10.3 49.85,2.98 47.37,5.46 44.28,5.46 40.85,8.89 IC1.12
PHONE_TX/U_RX
  Top 0.305: U$10.4 48.32,9.37 44.93,9.37 42.6,11.71 IC1.13
PWR
  Top 0.762: 26.36,5.08 FUSE1.P$2 FUSE1.P$3 26.36,5.08 | 26.36,5.08 17.63,5.08 U$8.1 6.47,12.04 FUSE.P$4 FUSE.P$1
RESET  (via drill 0.35)
  Top 0.254: IC1.7 38.35,14.78 v38.84,15.27 | JP2.1 R12.1
  Bottom 0.254: v38.84,15.27 40.64,17.07 40.64,20.32 43.26,22.94 46.15,22.94 48.26,25.04 JP2.1
RGB_BLUE  (via drill 0.35)
  Top 0.254: IC1.21 51.55,19.03 Q1.1 53.23,18.94 v53.34,19.05
  Bottom 0.254: v53.34,19.05 54.93,20.64 R5.2
RGB_GREEN  (via drill 0.35)
  Top 0.254: IC1.22 45.14,19.53 v45.57,19.96 | R9.2 v53.2,23
  Bottom 0.254: v45.57,19.96 49.02,19.96 Q2.1 50.92,21.86 50.92,22.21 51.72,23 v53.2,23
RGB_RED  (via drill 0.35)
  Top 0.254: IC1.18 44.37,17.53 v44.6,17.3
  Bottom 0.254: R4.2 50.33,16.31 Q6.1 44.74,17.16 v44.6,17.3
SWCLK  (via drill 0.35)
  Top 0.305: IC1.37 33.6,21.08 v34.51,21.99
  Bottom 0.305: v34.51,21.99 35.56,23.04 35.64,23.04 36.04,23.44 36.04,23.52 37.11,24.59 38.79,24.59 40.64,26.44 JP2.4
SWDIO
  Top 0.305: JP2.3 43.18,24.94 42.77,24.54 42.34,24.11 41.35,23.11 41.35,21.74 40.13,20.52 37.06,20.52 36.35,21.23 36.35,21.24 IC1.34
TC_
  Top 0.254: D7.A 39.3,35.88 R58.1
TC_LED
  Top 0.254: IC1.30 38.35,23.82 39.32,24.79 39.32,31.95 U$9.1
TC_VALUE
  Top 0.254: IC1.17 41.47,17.03 41.07,17.42 41.07,20.75 44.3,23.98 44.3,40.08 45.9,41.68 TC_POT.COMMON

### Text on the board
tNames: Illini Formula Electric | Dashboard v2.0 Apollo 2019 | Nick Tuczak | 1 | 10 | 1 | 10 | 1 | 10 | DRS POT | TC POT | CURRENT POT | IMD FAULT | BSPD FAULT | BMS FAULT | 1